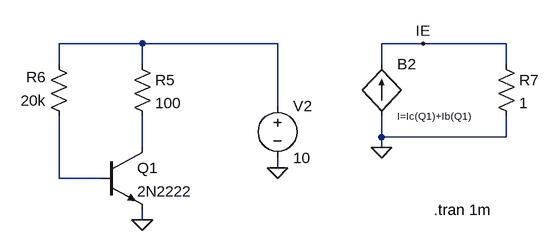
[diagram p0: schematic BV Analise Circuito.asc]
BV Analise Circuito.asc, the LTspice schematic file:
Version 4
SHEET 1 880 680
WIRE 160 -320 32 -320
WIRE 368 -320 160 -320
WIRE 592 -320 528 -320
WIRE 720 -320 592 -320
WIRE 32 -288 32 -320
WIRE 160 -288 160 -320
WIRE 528 -288 528 -320
WIRE 720 -288 720 -320
WIRE 368 -224 368 -320
WIRE 528 -176 528 -208
WIRE 720 -176 720 -208
WIRE 720 -176 528 -176
WIRE 160 -160 160 -208
WIRE 528 -160 528 -176
WIRE 368 -128 368 -144
WIRE 32 -112 32 -208
WIRE 96 -112 32 -112
WIRE 160 -48 160 -64
FLAG 368 -128 0
FLAG 160 -48 0
FLAG 528 -160 0
FLAG 592 -320 IE
SYMBOL npn 96 -160 R0
SYMATTR InstName Q1
SYMATTR Value 2N2222
SYMBOL voltage 368 -240 R0
SYMATTR InstName V2
SYMATTR Value 10
SYMBOL res 144 -304 R0
SYMATTR InstName R5
SYMATTR Value 100
SYMBOL res 48 -192 R180
WINDOW 0 36 76 Left 2
WINDOW 3 36 40 Left 2
SYMATTR InstName R6
SYMATTR Value 20k
SYMBOL bi 528 -208 M180
WINDOW 0 24 80 Left 2
WINDOW 3 24 0 Left 1
SYMATTR InstName B2
SYMATTR Value I=Ic(Q1)+Ib(Q1)
SYMBOL res 704 -304 R0
SYMATTR InstName R7
SYMATTR Value 1
TEXT 608 -64 Left 2 !.tran 1m

The netlist it stands for:
* BV Analise Circuito.asc
Q1 N002 N003 0 0 2N2222
V2 N001 0 10
R5 N001 N002 100
R6 N003 N001 20k
B2 0 IE I=Ic(Q1)+Ib(Q1)
R7 IE 0 1
.model NPN NPN
.model PNP PNP
.lib standard.bjt
.tran 1m
.backanno
.end